# EAGLE design relay (EAGLE 8.0.1)

## Sheet 1 of 2
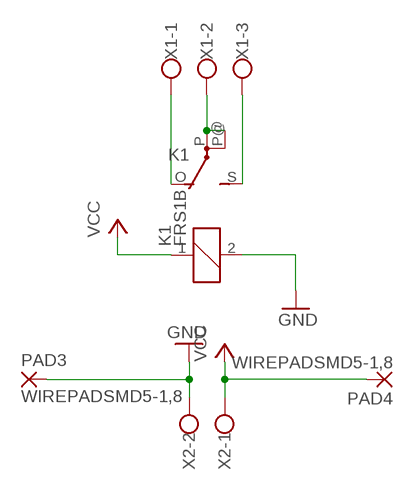
[diagram p0: schematic, sheet 1]

### Parts
K1  FRS1B  [FRS1B]
PAD3  WIREPADSMD5-1,8  [5-1,8]
PAD4  WIREPADSMD5-1,8  [5-1,8]
X1  W237-103  [W237-103]
X2  W237-102  [W237-102]

### Nets
GND: K1.2 PAD3.1(P) X2.2
N$1: K1.O(2:O) X1.1
N$2: K1.S(2:S) X1.3
N$6: K1.P(2:P) K1.P@(2:P) X1.2
VCC: K1.1 PAD4.1(P) X2.1

## Sheet 2 of 2
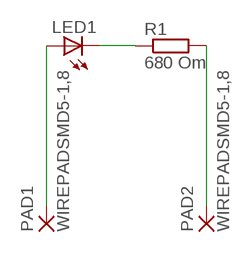
[diagram p1: schematic, sheet 2]

### Parts
LED1  LED3MM  [LED3MM]
PAD1  WIREPADSMD5-1,8  [5-1,8]
PAD2  WIREPADSMD5-1,8  [5-1,8]
R1  680 Om  R-EU_0207/7  [0207/7]

### Nets
GND_LED: PAD2.1(P) R1.2
N$3: LED1.K(C) R1.1
VCC_LED: LED1.A PAD1.1(P)

## Library data of the parts
K1 = relay:FRS1B: RELAY 1 x switch, same as V23101-D6-A201, Siemens; OC_FARNELL: unknown; OC_NEWARK: unknown
LED1 = led:LED: LED OSRAM: - CHIPLED LG R971, LG N971, LY N971, LG Q971, LY Q971, LO R971, LY R971 LH N974, LH R974 LS Q976, LO Q976, LY Q976 LO Q996 - Hyper CHIPLED LW Q18S LB Q993, LB Q99A, LB R99A - SideLED LS A670, LO A670, LY A670, LG A670, LP A670 LB A673, LV A673, LT A673, LW A673 LH A674 LY A675 LS A676, LA A676, LO A676, LY A676, LW A676 LS A679, LY A679, LG A679 - Hyper Micro SIDELED® LS Y876, LA Y876, LO Y876, LY Y876 LT Y87S - SmartLED LW L88C, LW L88S LB L89C, LB L89S, LG L890 LS L89K, LO L89K, LY L89K LS L896, LA L896, LO L896, LY L896 - TOPLED LS T670, LO T670, LY T670, LG T670, LP T670 LSG T670, LSP T670, LSY T670, LOP T670, LYG T670 LG T671, LOG T671, LSG T671 LB T673, LV T673, LT T673, LW T673 LH T674 LS T676, LA T676, LO T676, LY T676, LB T676, LH T676, LSB T676, LW T676 LB T67C, LV T67C, LT T67C, LS T67K, LO T67K, LY T67K, LW E67C LS E67B, LA E67B, LO E67B, LY E67B, LB E67C, LV E67C, LT E67C LW T67C LS T679, LY T679, LG T679 LS T770, LO T770, LY T770, LG T770, LP T770 LB T773, LV T773, LT T773, LW T773 LH T774 LS E675, LA E675, LY E675, LS T675 LS T776, LA T776, LO T776, LY T776, LB T776 LHGB T686 LT T68C, LB T68C - Hyper Mini TOPLED® LB M676 - Mini TOPLED Santana® LG M470 LS M47K, LO M47K, LY M47K Source: http://www.osram.convergy.de LUXEON: - LUMILED® LXK2-PW12-R00, LXK2-PW12-S00, LXK2-PW14-U00, LXK2-PW14-V00 LXK2-PM12-R00, LXK2-PM12-S00, LXK2-PM14-U00 LXK2-PE12-Q00, LXK2-PE12-R00, LXK2-PE12-S00, LXK2-PE14-T00, LXK2-PE14-U00 LXK2-PB12-K00, LXK2-PB12-L00, LXK2-PB12-M00, LXK2-PB14-N00, LXK2-PB14-P00, LXK2-PB14-Q00 LXK2-PR12-L00, LXK2-PR12-M00, LXK2-PR14-Q00, LXK2-PR14-R00 LXK2-PD12-Q00, LXK2-PD12-R00, LXK2-PD12-S00 LXK2-PH12-R00, LXK2-PH12-S00 LXK2-PL12-P00, LXK2-PL12-Q00, LXK2-PL12-R00 Source: www.luxeon.com KINGBRIGHT: KA-3528ASYC Source: www.kingbright.com
PAD1-PAD4 = wirepad:WIREPAD: Wire PAD connect wire on PCB
R1 = resistor:R-EU_: RESISTOR, European symbol
X1 = con-wago-500:W237-103: WAGO SCREW CLAMP; MPN: 237-103; OC_FARNELL: unknown; OC_NEWARK: 18M7116
X2 = con-wago-500:W237-102: WAGO SCREW CLAMP; MPN: 237-102; OC_FARNELL: unknown; OC_NEWARK: 70K9898

## Board
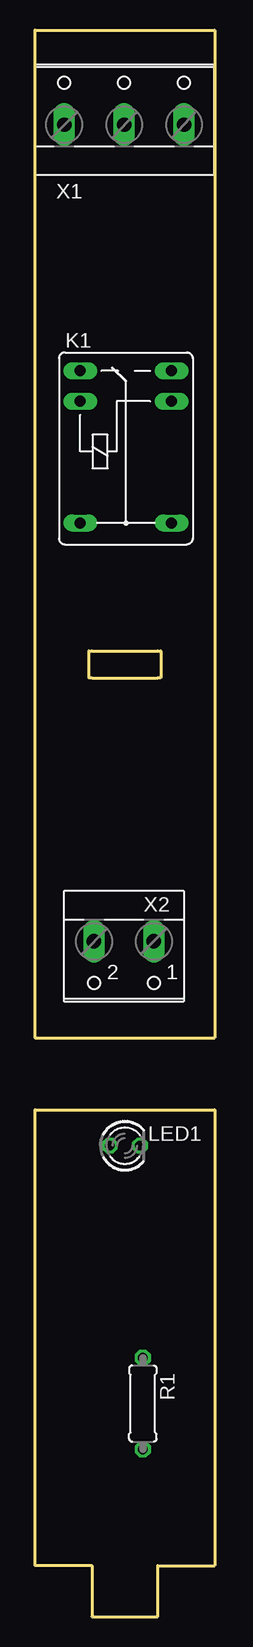
[diagram p2: board, top side]
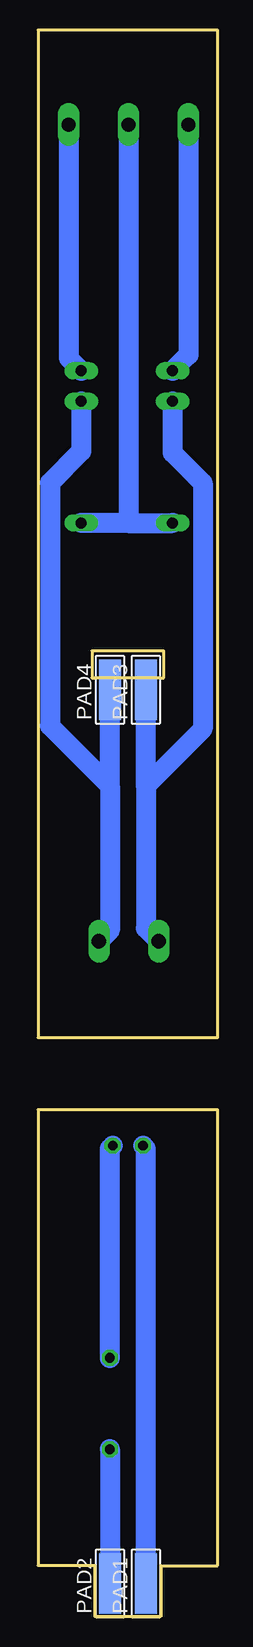
[diagram p3: board, bottom side, seen from below]

Size 15 x 132.25 mm. Coordinates in mm from the lower left corner, seen from the top.
Outline: 0,132.25 15,132.25 15,48.25 0,48.25 0,132.25
Outline: 4.75,4.25 4.75,0 10.25,0 10.25,4.25 15,4.25 15,42.25 0,42.25 0,4.25 4.75,4.25
Outline: 4.75,78.25 10.25,78.25 10.5,78.25 10.5,80.5 10.25,80.5 4.75,80.5 4.5,80.5 4.5,78.25 4.75,78.25
Copper layers (1*16): Top 0.035mm / dielectric 1.5mm / Bottom 0.035mm
Design rules "default": minimum track width 10mil, minimum drill 24mil, track to track 8mil, track to pad 8mil, pad to pad 8mil, via to via 8mil, smd to smd 8mil, copper to edge 40mil, drill to drill 8mil, minimum pad ring 10mil, minimum via ring 8mil, stop-mask expansion 4mil, vias tented up to drill 0mil, thermal gap 10mil

### Footprints (pad centres in the part's own frame; a part is rotated, then mirrored left to right if it is on the bottom)
FRS1B = drill 0.914 long: 1 0,3.81; 2 0,-3.81; O -2.54,-3.81; P 10.16,3.81; P@ 10.16,-3.81; S -2.54,3.81
LED3MM = drill 0.813 octagon: A -1.27,0; K 1.27,0
5-1,8 = smd 1.829 x 5.08: 1 0,0
0207/7 = drill 0.813 octagon: 1 -3.81,0; 2 3.81,0
W237-103 = drill 1.194 long: 1 -5,-1.29; 2 0,-1.29; 3 5,-1.29
W237-102 = drill 1.194 long: 1 -2.5,-1.27; 2 2.5,-1.27

### Placement (x,y rotation side)
K1  7.58,101.31 270 top
LED1  7.5,39.25 0 top
PAD1  6,2.75 0 bottom
PAD2  9,2.75 0 bottom
PAD3  6,77.25 0 bottom
PAD4  9,77.25 0 bottom
R1  9,17.75 270 top
X1  7.44,125.65 0 top
X2  7.42,55.01 180 top

### Tracks (layer width: path | path; a pad name or v marks a point on that pad's centre or on a via)
GND
  Bottom 1.676: K1.2 3.77,97.02 1.25,94.5 1.25,74 6,69.25 | X2.2 6,57.36 6,69.25 | 6,69.25 PAD3.1
GND_LED
  Bottom 1.676: R1.2 PAD2.1
N$1
  Bottom 1.676: X1.1 2.44,105.18 K1.O
N$2
  Bottom 1.676: X1.3 12.44,104.9 K1.S
N$3
  Bottom 1.676: R1.1 9,39.02 LED1.K
N$6
  Bottom 1.676: 7.5,91.15 K1.P@ | 7.5,91.15 K1.P | X1.2 7.44,91.21 7.5,91.15
VCC
  Bottom 1.676: X2.1 9,57.2 9,69.25 | K1.1 11.39,97.11 14,94.5 14,74.25 9,69.25 | 9,69.25 PAD4.1
VCC_LED
  Bottom 1.676: PAD1.1 6,39.02 LED1.A